# Altium schematic sheet US_EPS_GHW.SchDoc
size A4
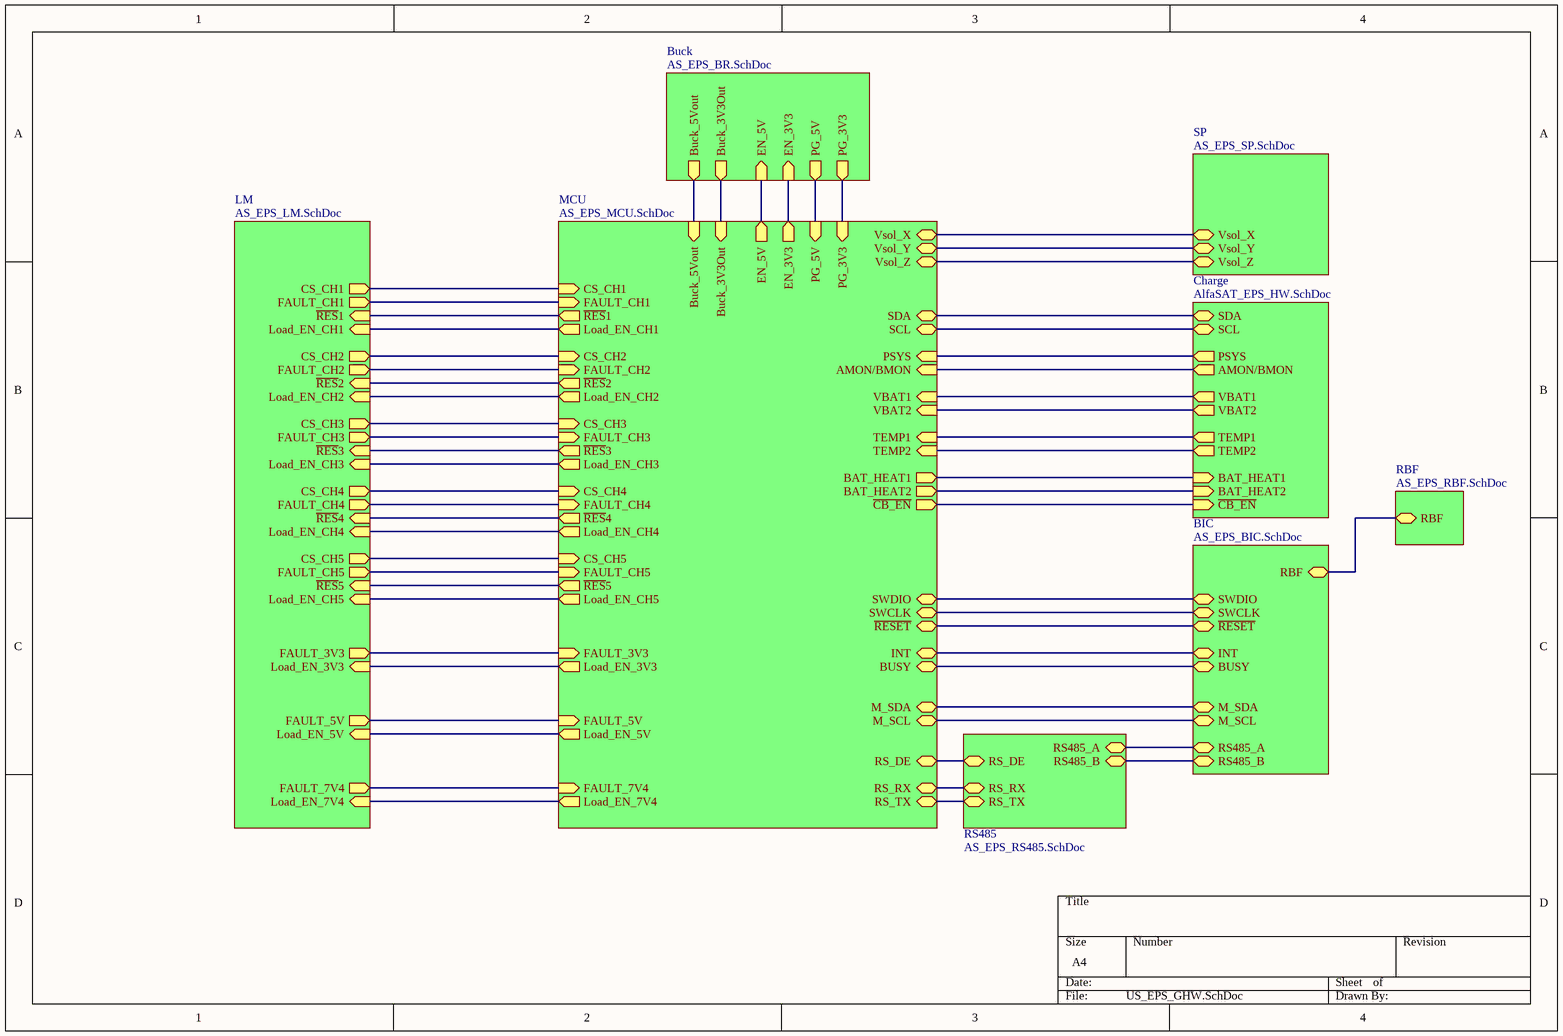
[diagram p0: US_EPS_GHW.SchDoc]

## Sub-sheets
BIC = AS_EPS_BIC.SchDoc: RBF, RS485_A, RS485_B, M_SCL, M_SDA, BUSY, INT, SWDIO, SWCLK, ~{RESET}
Buck = AS_EPS_BR.SchDoc: Buck_5Vout (out), Buck_3V3Out (out), EN_5V (in), EN_3V3 (in), PG_5V (out), PG_3V3 (out)
Charge = AlfaSAT_EPS_HW.SchDoc: AMON/BMON (out), PSYS (out), VBAT2 (out), TEMP2 (out), VBAT1 (out), TEMP1 (out), BAT_HEAT2 (in), BAT_HEAT1 (in), SCL, SDA, ~{CB_EN} (in)
LM = AS_EPS_LM.SchDoc: CS_CH1 (out), ~{RES}1 (in), FAULT_CH1 (out), Load_EN_CH1 (in), CS_CH2 (out), ~{RES}2 (in), FAULT_CH2 (out), Load_EN_CH2 (in), CS_CH3 (out), ~{RES}3 (in), FAULT_CH3 (out), Load_EN_CH3 (in), CS_CH4 (out), ~{RES}4 (in), FAULT_CH4 (out), Load_EN_CH4 (in), CS_CH5 (out), ~{RES}5 (in), FAULT_CH5 (out), Load_EN_CH5 (in), FAULT_3V3 (out), Load_EN_3V3 (in), FAULT_5V (out), Load_EN_5V (in), FAULT_7V4 (out), Load_EN_7V4 (in)
MCU = AS_EPS_MCU.SchDoc: SDA, SCL, PSYS (in), AMON/BMON (in), VBAT1 (in), VBAT2 (in), TEMP1 (in), TEMP2 (in), BAT_HEAT1 (out), BAT_HEAT2 (out), EN_3V3 (out), EN_5V (out), Buck_3V3Out (in), Buck_5Vout (in), CS_CH1 (in), ~{RES}1 (out), FAULT_CH1 (in), Load_EN_CH1 (out), CS_CH2 (in), ~{RES}2 (out), FAULT_CH2 (in), Load_EN_CH2 (out), CS_CH3 (in), ~{RES}3 (out), FAULT_CH3 (in), Load_EN_CH3 (out), CS_CH4 (in), ~{RES}4 (out), FAULT_CH4 (in), Load_EN_CH4 (out), CS_CH5 (in), ~{RES}5 (out), FAULT_CH5 (in), Load_EN_CH5 (out), FAULT_3V3 (in), Load_EN_3V3 (out), FAULT_5V (in), Load_EN_5V (out), FAULT_7V4 (in), Load_EN_7V4 (out), RS_DE, RS_TX, RS_RX, SWDIO, SWCLK, ~{RESET}, INT, BUSY, M_SDA, M_SCL, Vsol_X, Vsol_Z, Vsol_Y, ~{CB_EN} (out), PG_5V (in), PG_3V3 (in)
RBF = AS_EPS_RBF.SchDoc: RBF
RS485 = AS_EPS_RS485.SchDoc: RS_TX, RS_RX, RS_DE, RS485_B, RS485_A
SP = AS_EPS_SP.SchDoc: Vsol_X, Vsol_Z, Vsol_Y

## Nets
(unnamed): sheet Charge/AMON/BMON, sheet MCU/AMON/BMON
(unnamed): sheet Charge/PSYS, sheet MCU/PSYS
(unnamed): sheet Charge/VBAT2, sheet MCU/VBAT2
(unnamed): sheet Charge/TEMP2, sheet MCU/TEMP2
(unnamed): sheet Charge/VBAT1, sheet MCU/VBAT1
(unnamed): sheet Charge/TEMP1, sheet MCU/TEMP1
(unnamed): sheet Charge/BAT_HEAT2, sheet MCU/BAT_HEAT2
(unnamed): sheet Charge/BAT_HEAT1, sheet MCU/BAT_HEAT1
(unnamed): sheet Charge/SCL, sheet MCU/SCL
(unnamed): sheet Charge/SDA, sheet MCU/SDA
(unnamed): sheet Charge/~{CB_EN}, sheet MCU/~{CB_EN}
(unnamed): sheet MCU/EN_3V3, sheet Buck/EN_3V3
(unnamed): sheet MCU/EN_5V, sheet Buck/EN_5V
(unnamed): sheet MCU/Buck_3V3Out, sheet Buck/Buck_3V3Out
(unnamed): sheet MCU/Buck_5Vout, sheet Buck/Buck_5Vout
(unnamed): sheet MCU/CS_CH1, sheet LM/CS_CH1
(unnamed): sheet MCU/~{RES}1, sheet LM/~{RES}1
(unnamed): sheet MCU/FAULT_CH1, sheet LM/FAULT_CH1
(unnamed): sheet MCU/Load_EN_CH1, sheet LM/Load_EN_CH1
(unnamed): sheet MCU/CS_CH2, sheet LM/CS_CH2
(unnamed): sheet MCU/~{RES}2, sheet LM/~{RES}2
(unnamed): sheet MCU/FAULT_CH2, sheet LM/FAULT_CH2
(unnamed): sheet MCU/Load_EN_CH2, sheet LM/Load_EN_CH2
(unnamed): sheet MCU/CS_CH3, sheet LM/CS_CH3
(unnamed): sheet MCU/~{RES}3, sheet LM/~{RES}3
(unnamed): sheet MCU/FAULT_CH3, sheet LM/FAULT_CH3
(unnamed): sheet MCU/Load_EN_CH3, sheet LM/Load_EN_CH3
(unnamed): sheet MCU/CS_CH4, sheet LM/CS_CH4
(unnamed): sheet MCU/~{RES}4, sheet LM/~{RES}4
(unnamed): sheet MCU/FAULT_CH4, sheet LM/FAULT_CH4
(unnamed): sheet MCU/Load_EN_CH4, sheet LM/Load_EN_CH4
(unnamed): sheet MCU/CS_CH5, sheet LM/CS_CH5
(unnamed): sheet MCU/~{RES}5, sheet LM/~{RES}5
(unnamed): sheet MCU/FAULT_CH5, sheet LM/FAULT_CH5
(unnamed): sheet MCU/Load_EN_CH5, sheet LM/Load_EN_CH5
(unnamed): sheet MCU/FAULT_3V3, sheet LM/FAULT_3V3
(unnamed): sheet MCU/Load_EN_3V3, sheet LM/Load_EN_3V3
(unnamed): sheet MCU/FAULT_5V, sheet LM/FAULT_5V
(unnamed): sheet MCU/Load_EN_5V, sheet LM/Load_EN_5V
(unnamed): sheet MCU/FAULT_7V4, sheet LM/FAULT_7V4
(unnamed): sheet MCU/Load_EN_7V4, sheet LM/Load_EN_7V4
(unnamed): sheet MCU/RS_DE, sheet RS485/RS_DE
(unnamed): sheet MCU/RS_TX, sheet RS485/RS_TX
(unnamed): sheet MCU/RS_RX, sheet RS485/RS_RX
(unnamed): sheet MCU/SWDIO, sheet BIC/SWDIO
(unnamed): sheet MCU/SWCLK, sheet BIC/SWCLK
(unnamed): sheet MCU/~{RESET}, sheet BIC/~{RESET}
(unnamed): sheet MCU/INT, sheet BIC/INT
(unnamed): sheet MCU/BUSY, sheet BIC/BUSY
(unnamed): sheet MCU/M_SDA, sheet BIC/M_SDA
(unnamed): sheet MCU/M_SCL, sheet BIC/M_SCL
(unnamed): sheet MCU/Vsol_X, sheet SP/Vsol_X
(unnamed): sheet MCU/Vsol_Z, sheet SP/Vsol_Z
(unnamed): sheet MCU/Vsol_Y, sheet SP/Vsol_Y
(unnamed): sheet MCU/PG_5V, sheet Buck/PG_5V
(unnamed): sheet MCU/PG_3V3, sheet Buck/PG_3V3
(unnamed): sheet RBF/RBF, sheet BIC/RBF
(unnamed): sheet RS485/RS485_B, sheet BIC/RS485_B
(unnamed): sheet RS485/RS485_A, sheet BIC/RS485_A